# EAGLE schematic comm-board (EAGLE 8.1.0)
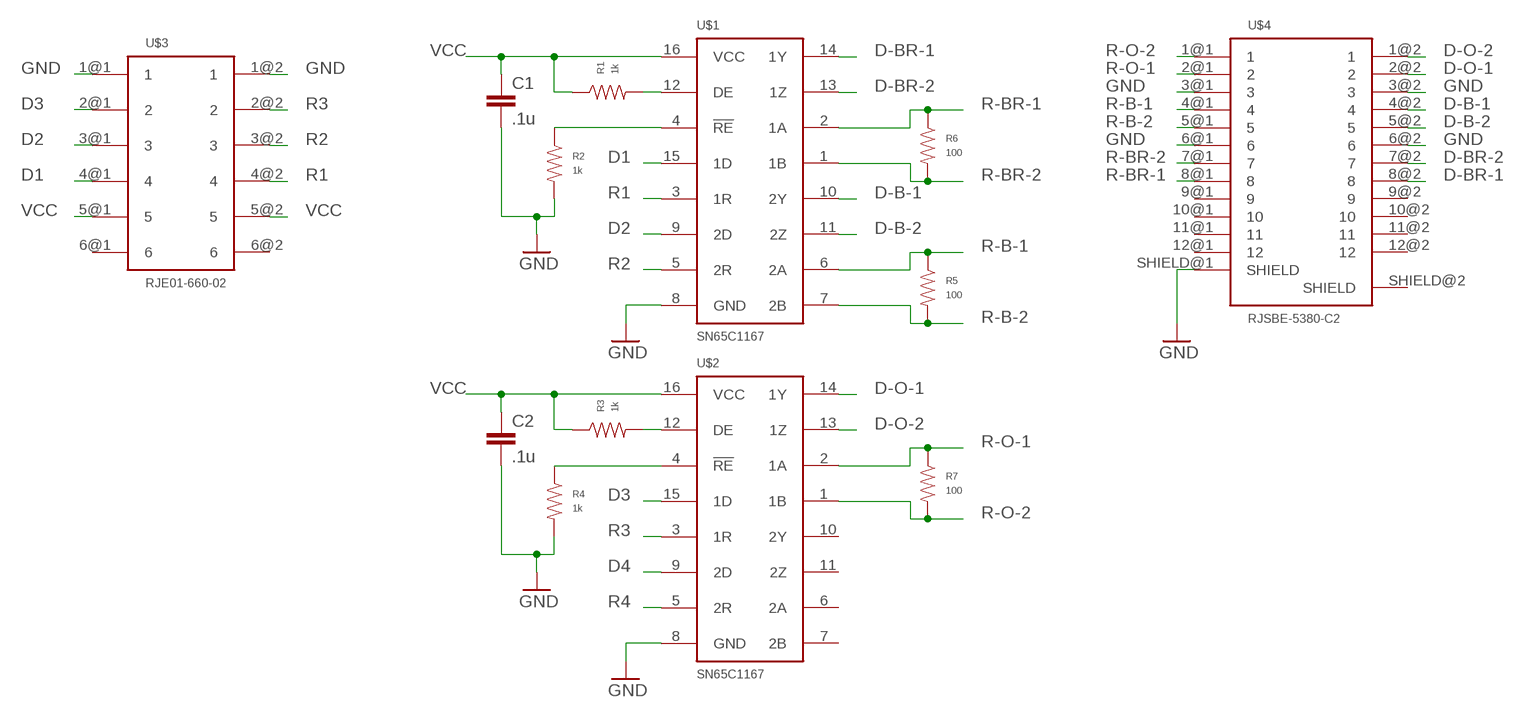
[diagram p0: schematic, sheet 1]

## Parts
C1  .1u  CAP0805  [0805]
C2  .1u  CAP0805  [0805]
R1  1k  RESISTOR_0805  [R0805]
R2  1k  RESISTOR_0805  [R0805]
R3  1k  RESISTOR_0805  [R0805]
R4  1k  RESISTOR_0805  [R0805]
R5  100  RESISTOR_0805  [R0805]
R6  100  RESISTOR_0805  [R0805]
R7  100  RESISTOR_0805  [R0805]
U$1  SN65C1167  [SOP-16]
U$2  SN65C1167  [SOP-16]
U$3  RJE01-660-02  [RJE01-660-02]
U$4  RJSBE-5380-C2  [RJSBE-5380-C2]

## Nets
D1: U$1.15(1D) U$3.4@1
D2: U$1.9(2D) U$3.3@1
D3: U$2.15(1D) U$3.2@1
D4: U$2.9(2D)
D-B-1: U$1.10(2Y) U$4.4@2
D-B-2: U$1.11(2Z) U$4.5@2
D-BR-1: U$1.14(1Y) U$4.8@2
D-BR-2: U$1.13(1Z) U$4.7@2
D-O-1: U$2.14(1Y) U$4.2@2
D-O-2: U$2.13(1Z) U$4.1@2
GND: C1.2 C2.2 R2.P$2 R4.P$2 U$1.8(GND) U$2.8(GND) U$3.1@1 U$3.1@2 U$4.3@1 U$4.3@2 U$4.6@1 U$4.6@2 U$4.SHIELD@1(SHIELD)
N$1: R1.P$2 U$1.12(DE)
N$3: R2.P$1 U$1.4(!RE)
N$5: R3.P$2 U$2.12(DE)
N$6: R4.P$1 U$2.4(!RE)
R1: U$1.3(1R) U$3.4@2
R2: U$1.5(2R) U$3.3@2
R3: U$2.3(1R) U$3.2@2
R4: U$2.5(2R)
R-B-1: R5.P$1 U$1.6(2A) U$4.4@1
R-B-2: R5.P$2 U$1.7(2B) U$4.5@1
R-BR-1: R6.P$1 U$1.2(1A) U$4.8@1
R-BR-2: R6.P$2 U$1.1(1B) U$4.7@1
R-O-1: R7.P$1 U$2.2(1A) U$4.2@1
R-O-2: R7.P$2 U$2.1(1B) U$4.1@1
VCC: C1.1 C2.1 R1.P$1 R3.P$1 U$1.16(VCC) U$2.16(VCC) U$3.5@1 U$3.5@2
Unconnected: U$2.6(2A) U$2.7(2B) U$2.10(2Y) U$2.11(2Z) U$3.6@1 U$3.6@2 U$4.9@1 U$4.9@2 U$4.10@1 U$4.10@2 U$4.11@1 U$4.11@2 U$4.12@1 U$4.12@2 U$4.SHIELD@2(SHIELD)

## Library data of the parts
C1 C2 = SparkFun:CAP: Capacitor Standard 0603 ceramic capacitor, and 0.1" leaded capacitor.
R1-R7 = MF_Passives:RESISTOR: Library: MF_Passives Description: Device for Resistors. Manufacture part number (MPN), Voltage, Tolerance, and Wattage Rating can be added via Attributes. Check https://factory.macrofab.com/parts for the house parts list.; POPULATE: 1
U$1 U$2 = GARTH:SN65C1167
U$3 = GARTH:RJE01-660-02: Multi Port Non-Shielded 6P6C RJ-11 connector
U$4 = GARTH:RJSBE-5380-C2